# EAGLE design Wisol-Breakout (EAGLE 9.1.0)
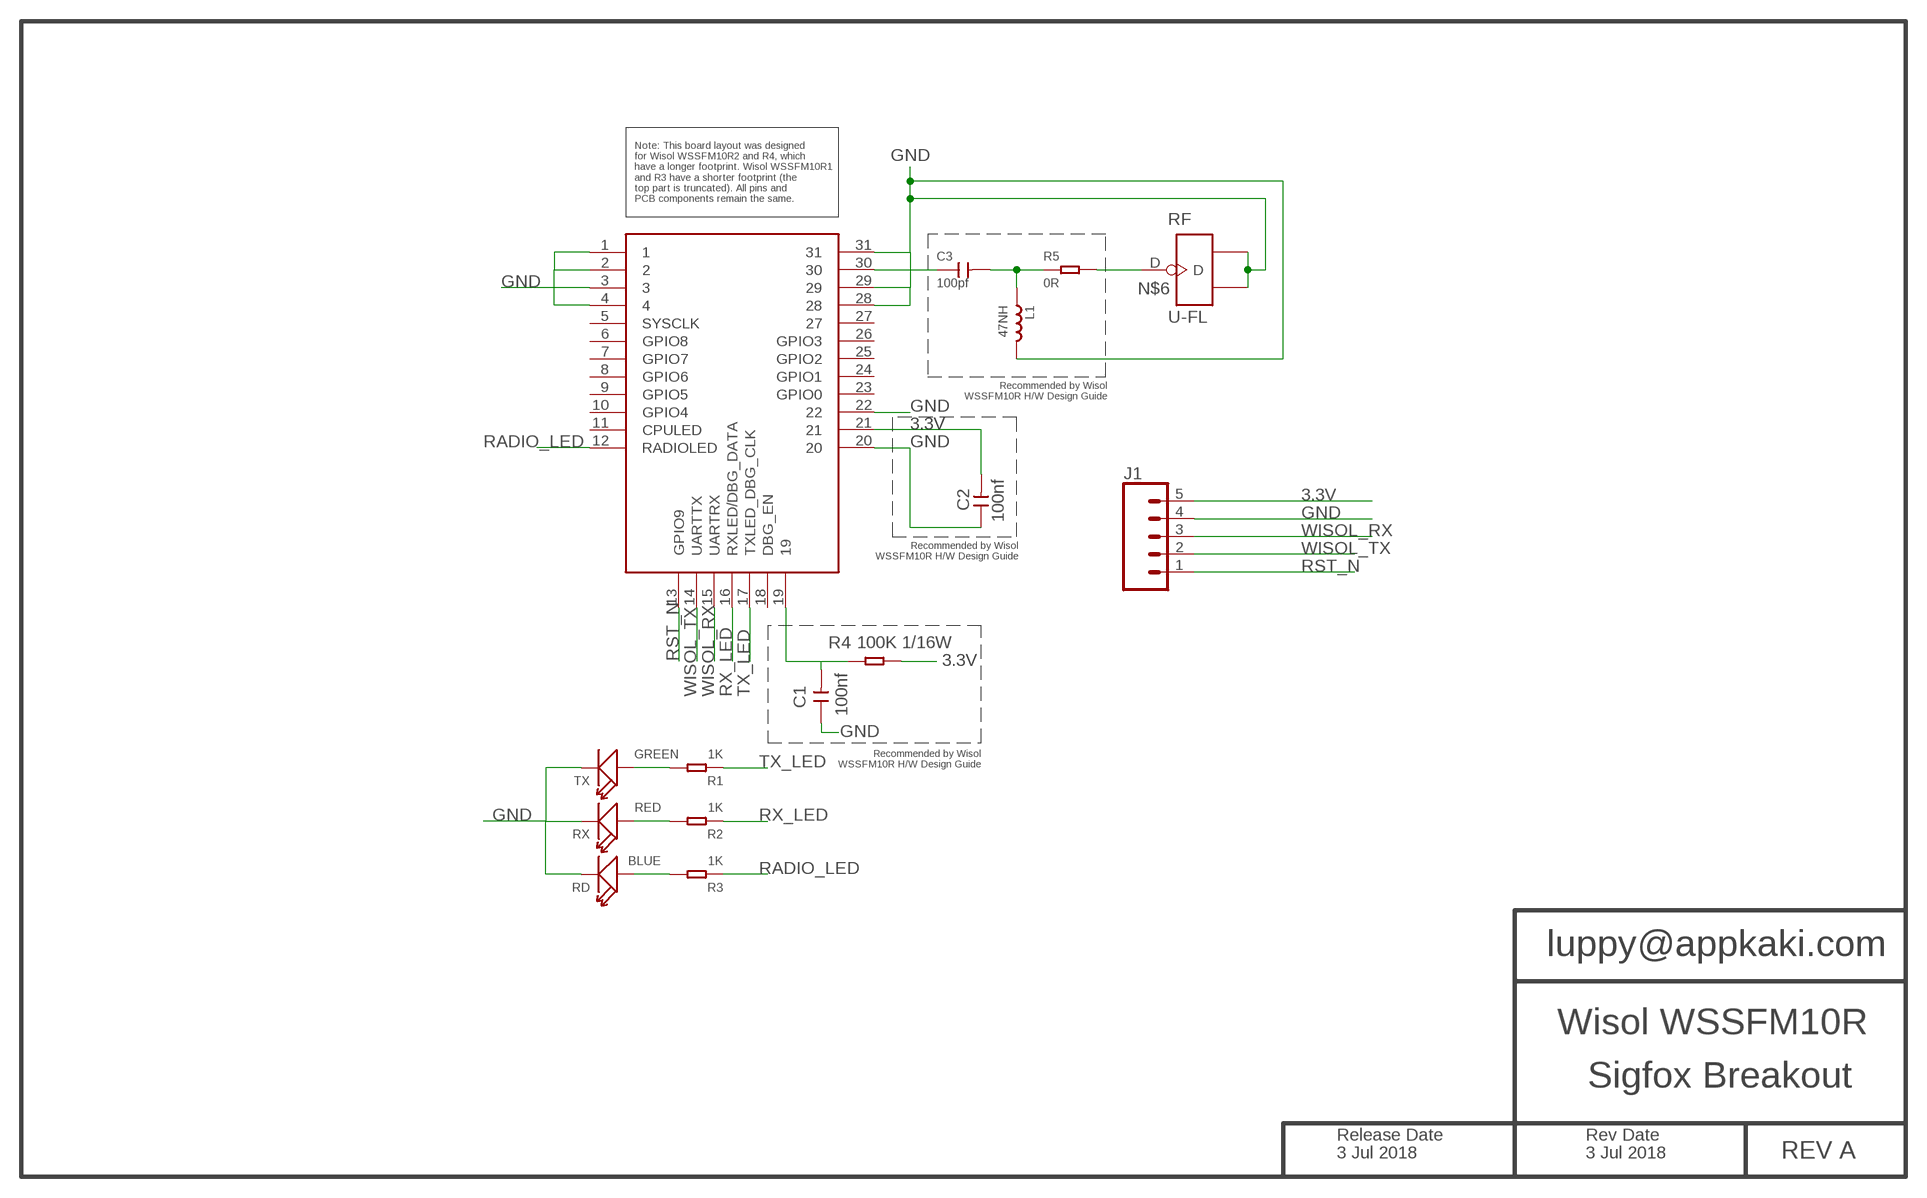
[diagram p0: schematic, sheet 1]

## Parts
C1  100nf  CERAMIC-100NF-25V-10%-X7R(0402)  [C0402]
C2  100nf  CERAMIC-100NF-25V-10%-X7R(0402)  [C0402]
C3  100pf  CERAMIC-100PF-50V-5%-NPO(0402)  [C0402]
J1  CONN_05  [1X05]
L1  47NH  SMD-INDUCTOR-15NH-5%-300MA(0402)  [L0402]
R1  1K  SMD-RES-1K-5%-1/16W(0402)  [R0402]
R2  1K  SMD-RES-1K-5%-1/16W(0402)  [R0402]
R3  1K  SMD-RES-1K-5%-1/16W(0402)  [R0402]
R4  100K 1/16W  SMD-RES-100K-5%-1/16W(0402)  [R0402]
R5  0R  SMD-RES-0R-5%-1/16W(0402)  [R0402]
RD  BLUE  SMD-LED-CLEAR-BLUE(0603)  [LED-0603]
RF  U-FL  ANTENNA-CONN-U-FL(3P)  [U-FL3P-SMD-2.6X2.6X1.0MM]
RX  RED  LED-SMD-RED-DIFFUSED(0603)  [LED-0603]
TX  GREEN  SMD-LED-CLEAR-GREEN(0603)  [LED-0603]
WSSFM10R  WSSFM10RWSSFM10R2R4  [WSSFM10R]

## Nets
3.3V: C2.2 J1.5 R4.2 WSSFM10R.21
GND: C1.1 C2.1 J1.4 L1.2 RD.- RF.GND1 RF.GND2 RX.- TX.- WSSFM10R.1 WSSFM10R.2 WSSFM10R.3 WSSFM10R.4 WSSFM10R.20 WSSFM10R.22 WSSFM10R.28 WSSFM10R.29 WSSFM10R.31
N$1: C1.2 R4.1 WSSFM10R.19
N$2: R1.2 TX.+
N$3: R2.2 RX.+
N$4: R3.2 RD.+
N$5: C3.2 L1.1 R5.1
N$6: R5.2 RF.D
RADIO_LED: R3.1 WSSFM10R.12(RADIOLED)
RF_OUT: C3.1 WSSFM10R.30
RST_N: J1.1 WSSFM10R.13(GPIO9)
RX_LED: R2.1 WSSFM10R.16(RXLED/DBG_DATA)
TX_LED: R1.1 WSSFM10R.17(TXLED_DBG_CLK)
WISOL_RX: J1.3 WSSFM10R.15(UARTRX)
WISOL_TX: J1.2 WSSFM10R.14(UARTTX)
Unconnected: WSSFM10R.5(SYSCLK) WSSFM10R.6(GPIO8) WSSFM10R.7(GPIO7) WSSFM10R.8(GPIO6) WSSFM10R.9(GPIO5) WSSFM10R.10(GPIO4) WSSFM10R.11(CPULED) WSSFM10R.18(DBG_EN) WSSFM10R.23(GPIO0) WSSFM10R.24(GPIO1) WSSFM10R.25(GPIO2) WSSFM10R.26(GPIO3) WSSFM10R.27

## Notes on the sheet
- Note: This board layout was designed 
  for Wisol WSSFM10R2 and R4, which 
  have a longer footprint. Wisol WSSFM10R1
  and R3 have a shorter footprint (the
  top part is truncated). All pins and
  PCB components remain the same.
- Recommended by Wisol
  WSSFM10R H/W Design Guide
- Recommended by Wisol
  WSSFM10R H/W Design Guide
- Recommended by Wisol
  WSSFM10R H/W Design Guide
- luppy@appkaki.com
- Wisol WSSFM10R
- Sigfox Breakout
- Release Date | Rev Date
- 3 Jul 2018 | 3 Jul 2018 | REV A

## Library data of the parts
C1 C2 = Seeed-Capacitor:CERAMIC-100NF-25V-10%-X7R(0402): 302010024; MPN: CC0402KRX7R8BB104
C3 = Seeed-Capacitor:CERAMIC-100PF-50V-5%-NPO(0402): 302010012; MPN: CC0402JRNPO9BN101
J1 = SparkFun-Connectors:CONN_05: Multi connection point. Often used as Generic Header-pin footprint for 0.1 inch spaced/style header connections On any of the 0.1 inch spaced packages, you can populate with these: Break Away Headers - Straight <https://www.sparkfun.com/products/116> (PRT-00116) Break Away Male Headers - Right Angle <https://www.sparkfun.com/products/553> (PRT-00553) Female Headers <https://www.sparkfun.com/products/115> (PRT-00115) Break Away Headers - Machine Pin <https://www.sparkfun.com/products/117> (PRT-00117) Break Away Female Headers - Swiss Machine Pin <https://www.sparkfun.com/products/743> (PRT-00743) For SCREWTERMINALS and SPRING TERMINALS visit here: Screw Terimnals on SparkFun.com <https://www.sparkfun.com/search/results?term=Screw+Terminals> (5mm/3.5mm/2.54mm spacing) This device is also useful as a general connection point to wire up your design to another part of your project. Our various solder wires solder well into these plated through hole pads. Hook-Up Wire - Assortment (Stranded, 22 AWG) <https://www.sparkfun.com/products/11375> (PRT-11375) Hook-Up Wire - Assortment (Solid Core, 22 AWG) <https://www.sparkfun.com/products/11367> (PRT-11367) View the entire wire category on our website here <https://www.sparkfun.com/categories/141> Special notes: Molex polarized connector foot print use with SKU : PRT-08231 with associated crimp pins and housings. 1MM SMD Version SKU: PRT-10208
L1 = Seeed-Inductor:SMD-INDUCTOR-15NH-5%-300MA(0402): 303010027; MPN: LQW15AN47NJ00D; VALUE: 15NH-300MA
R1-R3 = Seeed-Resistor:SMD-RES-1K-5%-1/16W(0402): 301010006; MPN: RC0402FR-071KL
R4 = Seeed-Resistor:SMD-RES-100K-5%-1/16W(0402): 301010033; MPN: RC0402JR-07100KL
R5 = Seeed-Resistor:SMD-RES-0R-5%-1/16W(0402): 301010000; MPN: RC0402JR-070RL
RD = Seeed-LED:SMD-LED-CLEAR-BLUE(0603): 304090045; MPN: 19-217-BHC-ZL1M2RY-3T; VALUE: BLUE-0603
RF = Seeed-Connector:ANTENNA-CONN-U-FL(3P): 320110048
RX = Seeed-LED:LED-SMD-RED-DIFFUSED(0603): 304090042; MPN: 19-217-R6C-AL1M2VY-3T; VALUE: RED-0603
TX = Seeed-LED:SMD-LED-CLEAR-GREEN(0603): 304090043; MPN: 19-217-G7C-AN1P2-3T; VALUE: GREEN-0603
WSSFM10R = WisolWSSFM10R:WSSFM10R

## Board
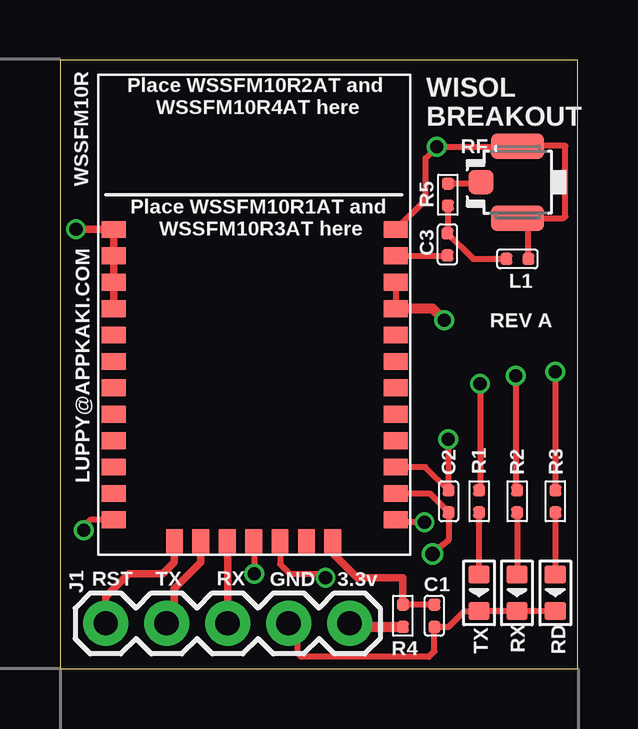
[diagram p1: board, top side]
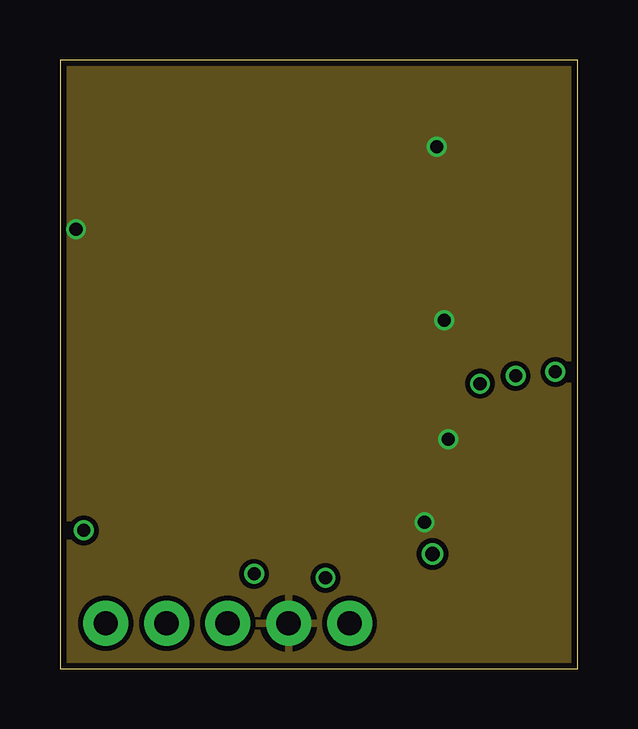
[diagram p2: board, inner layer Route2]
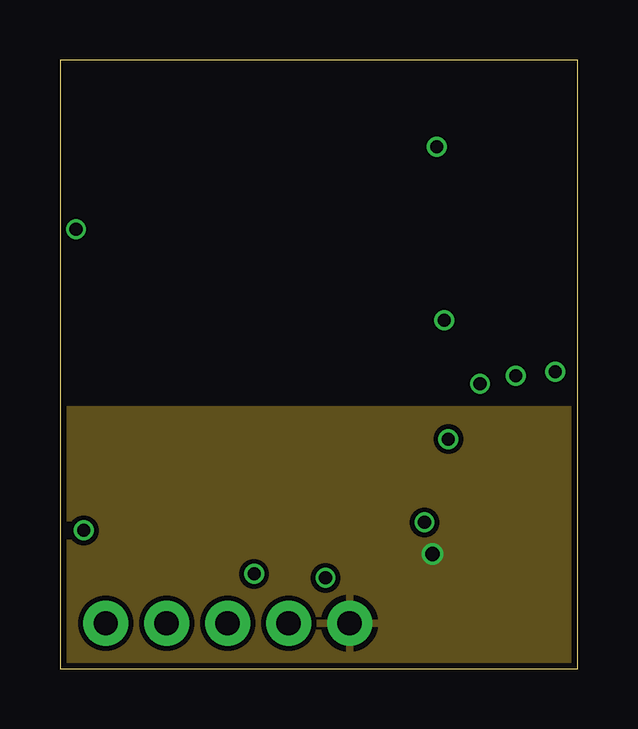
[diagram p3: board, inner layer Route15]
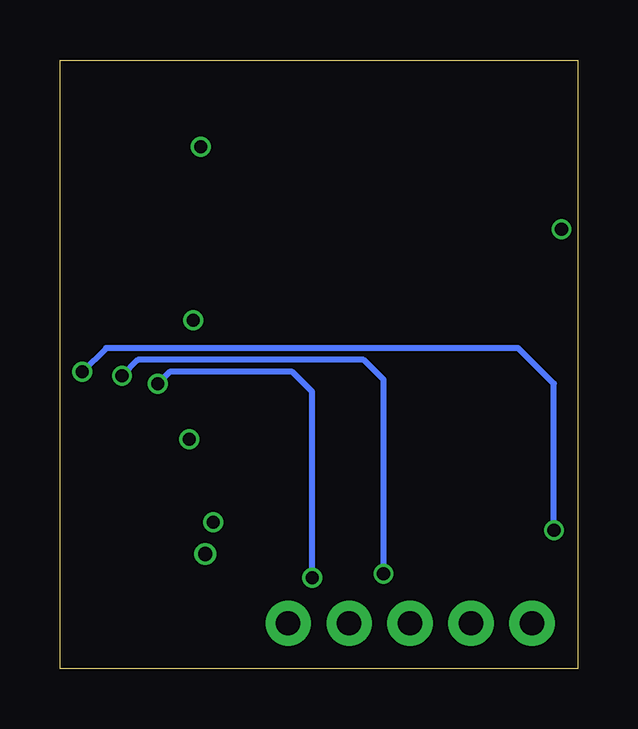
[diagram p4: board, bottom side, seen from below]

Size 21.57 x 25.37 mm. Coordinates in mm from the lower left corner, seen from the top.
Outline: 0,0 21.57,0 21.57,25.38 0,25.38 0,0
Copper layers (1*2*15*16): Top 0.035mm / dielectric 0.2mm / Route2 0.0175mm / dielectric 0.3mm / Route15 0.0175mm / dielectric 0.2mm / Bottom 0.035mm
Design rules "SeeedStudio_4layer_DRU_no_angle_20140221": minimum track width 8mil, minimum drill 12mil, track to track 8mil, track to pad 8mil, pad to pad 8mil, via to via 8mil, smd to smd 0mil, copper to edge 10mil, drill to drill 8mil, minimum pad ring 6mil, minimum via ring 4mil, stop-mask expansion 4mil, vias tented up to drill 25mil, thermal gap 10mil
tRestrict: area 1.6,6.4 to 14.6,24.4

### Footprints (pad centres in the part's own frame; a part is rotated, then mirrored left to right if it is on the bottom)
C0402 = smd 0.5 x 0.5: 1 0,0.463; 2 0,-0.463
1X05 = drill 1.016 pad 1.88: 1 0,0; 2 2.54,0; 3 5.08,0; 4 7.62,0; 5 10.16,0
L0402 = smd 0.5 x 0.5: 1 -0.463,0; 2 0.463,0
R0402 = smd 0.5 x 0.5: 1 0,0.463; 2 0,-0.463
LED-0603 = smd 0.762 x 0.889: + -0.762,0; - 0.762,0
U-FL3P-SMD-2.6X2.6X1.0MM = smd 1.05 x 1: D -1.524,0 | smd 2.2 x 1.05: GND1 0,1.5; GND2 0,-1.5
WSSFM10R = smd 1 x 0.7: 1 0.65,13.55; 2 0.65,12.45; 3 0.65,11.35; 4 0.65,10.25; 5 0.65,9.15; 6 0.65,8.05; 7 0.65,6.95; 8 0.65,5.85; 9 0.65,4.75; 10 0.65,3.65; 11 0.65,2.55; 12 0.65,1.45; 20 12.4,1.45; 21 12.4,2.55; 22 12.4,3.65; 23 12.4,4.75; 24 12.4,5.85; 25 12.4,6.95; 26 12.4,8.05; 27 12.4,9.15; 28 12.4,10.25; 29 12.4,11.35; 30 12.4,12.45; 31 12.4,13.55 | smd 0.7 x 1: 13 3.18,0.56; 14 4.28,0.56; 15 5.38,0.56; 16 6.48,0.56; 17 7.58,0.56; 18 8.68,0.56; 19 9.78,0.56

### Placement (x,y rotation side)
C1  15.6,2.22 180 top
C2  16.19,6.98 0 top
C3  16.14,17.69 180 top
J1  1.91,1.91 0 top
L1  19.06,17.09 0 top
R1  17.46,6.98 0 top
R2  19.05,6.98 0 top
R3  20.64,6.98 0 top
R4  14.29,2.22 0 top
R5  16.17,19.76 180 top
RD  20.64,3.18 270 top
RF  19.06,20.28 0 top
RX  19.04,3.18 270 top
TX  17.46,3.18 270 top
WSSFM10R  1.59,4.76 0 top

### Tracks (layer width: path | path; a pad name or v marks a point on that pad's centre or on a via)
3.3V  (via drill 0.6)
  Top 0.254: v15.52,4.79 15.73,5.08 15.81,5.08 16.19,5.37 C2.2 15.4,7.31 WSSFM10R.21
  Top 0.305: J1.5 12.21,1.76
  Top 0.406: 12.21,1.76 R4.2
  pour Route15: 0,10.8 21.59,10.8 21.59,0 0,0
GND  (via drill 0.55)
  Top 0.254: J1.4 9.91,1.52 9.91,0.66 10.06,0.51 15.37,0.51 15.6,0.74 C1.1 16.19,1.76 16.85,2.41 TX.- RX.- RD.- | WSSFM10R.29 WSSFM10R.28 | v16.18,9.58 16.18,9.41 16.19,9.4 C2.1 15.23,8.41 WSSFM10R.22 | v15.19,6.11 14.09,6.11 WSSFM10R.20 | L1.2 19.52,18.33 RF.GND2 20.98,18.78 21.05,18.86 21.05,21.8 19.08,21.8 RF.GND1 19.04,21.76 v15.7,21.76 15.23,21.29 15.23,19.56 WSSFM10R.31
  Top 0.305: WSSFM10R.4 WSSFM10R.3 WSSFM10R.2 WSSFM10R.1 0.84,18.31 0.83,18.33 v0.67,18.33
  Top 0.406: v16.01,14.53 15.53,15.01 WSSFM10R.28
  pour Route2: 0,0 21.59,0 21.59,25.4 0,25.4
N$1
  Top 0.254: C1.2 R4.1
  Top 0.305: R4.1 14.29,3.81 12.38,3.81 11.37,4.83 WSSFM10R.19
N$2
  Top 0.254: TX.+ R1.2
N$3
  Top 0.254: R2.2 19.05,3.95 RX.+
N$4
  Top 0.254: R3.2 RD.+
N$5
  Top 0.254: R5.1 16.17,18.15 C3.2 17.21,17.09 L1.1
N$6
  Top 0.254: RF.D 17.48,20.23 R5.2
RADIO_LED  (via drill 0.55)
  Top 0.254: WSSFM10R.12 1.26,6.21 0.99,5.94 v0.99,5.78 | v20.64,12.38 R3.1
  Bottom 0.254: v0.99,5.78 0.99,11.89 2.48,13.37 19.65,13.37 v20.64,12.38
RF_OUT
  Top 0.254: WSSFM10R.30 16.13,17.21 C3.1
RST_N
  Top 0.305: J1.1 1.91,3.02 2.86,3.97 4.29,3.97 4.76,4.45 WSSFM10R.13
RX_LED  (via drill 0.55)
  Top 0.254: WSSFM10R.16 8.09,5.32 v8.09,3.96 | v18.99,12.22 18.99,7.7 R2.1
  Bottom 0.254: v8.09,3.96 8.09,12.05 8.92,12.88 18.33,12.88 v18.99,12.22
TX_LED  (via drill 0.55)
  Top 0.254: WSSFM10R.17 9.17,4.37 9.58,3.96 10.9,3.96 v11.06,3.8 | v17.5,11.89 17.5,7.67 R1.1
  Bottom 0.254: v11.06,3.8 11.06,11.56 11.89,12.38 17.01,12.38 v17.5,11.89
WISOL_RX
  Top 0.305: J1.3 6.99,5.3 WSSFM10R.15
WISOL_TX
  Top 0.305: WSSFM10R.14 5.87,4.44 4.76,3.33 4.76,2.22 J1.2

### Text on the board
tPlace: WISOL / BREAKOUT | REV A | LUPPY@APPKAKI.COM | RST | TX | RX | GND | 3.3v